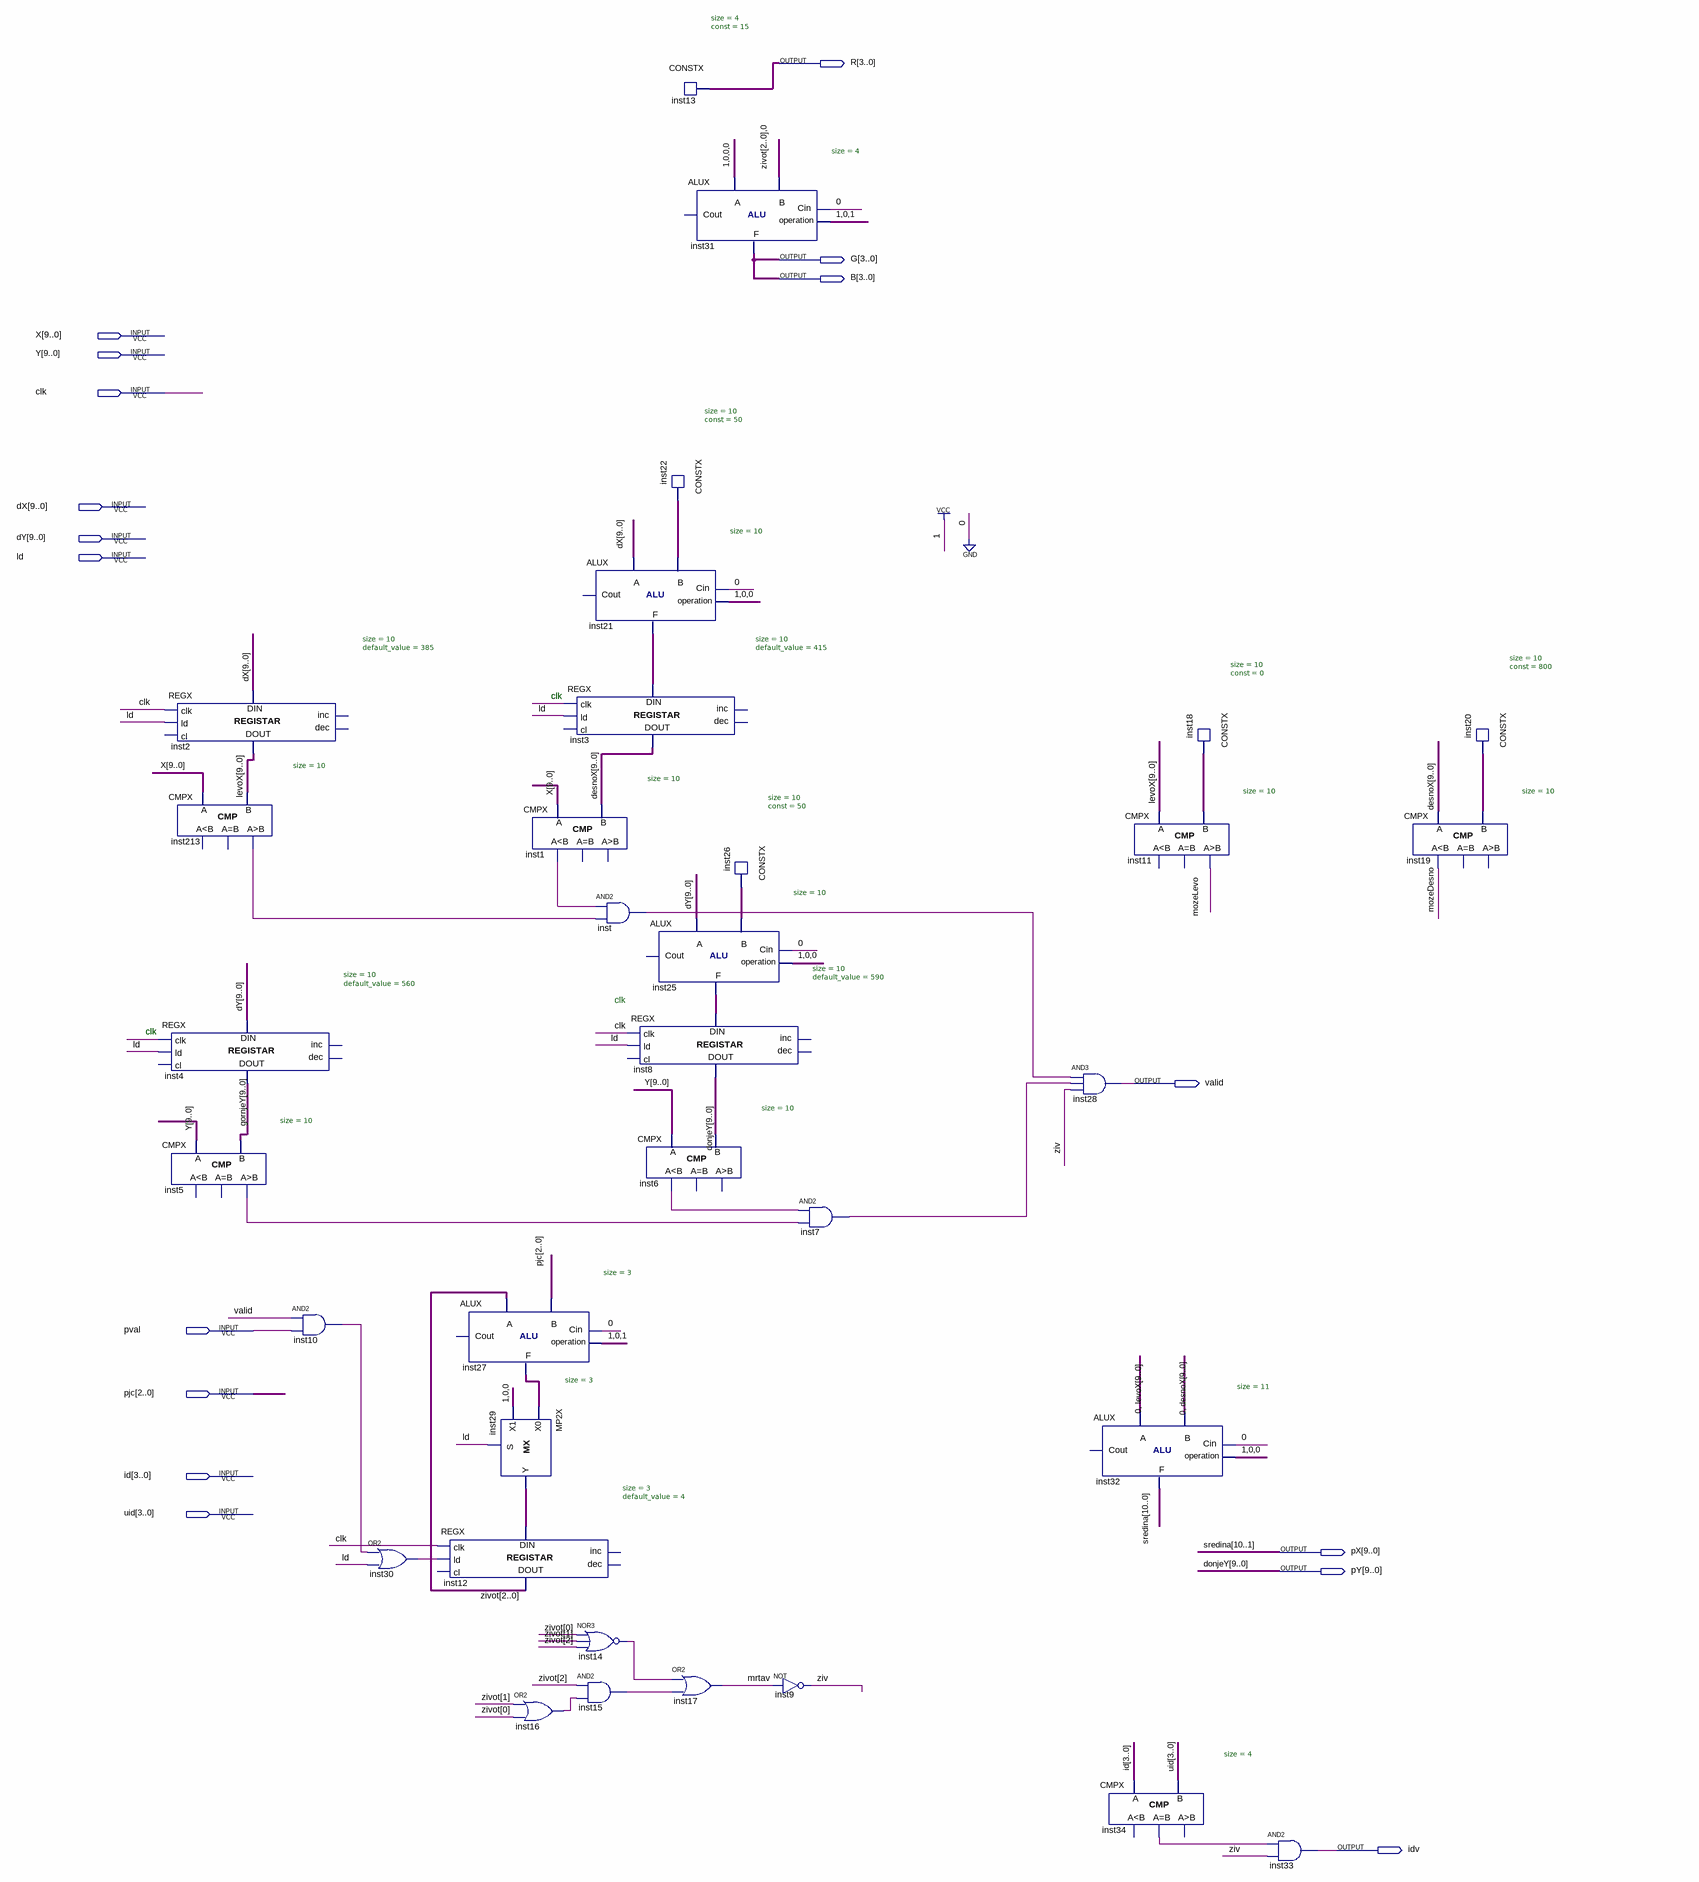
[diagram p0: schematic sheet]
// Quartus schematic neprijatelj.bdf as structural Verilog: 34 symbols, 17 pins
module neprijatelj (
  input  [9:0] X,
  input  [9:0] Y,
  input  clk,
  input  [9:0] dX,
  input  [9:0] dY,
  input  ld,
  input  pval,
  input  [2:0] pjc,
  input  [3:0] id,
  input  [3:0] uid,
  output [3:0] R,
  output [3:0] G,
  output [3:0] B,
  output valid,
  output [9:0] pX,
  output [9:0] pY,
  output idv
);

  wire inst1_ls, inst5_gr, inst6_ls, inst7_out, inst10_out, inst14_out, inst15_out, inst16_out, inst30_out,
       inst34_eq, inst213_gr, inst_out, mozeDesno, mozeLevo, mrtav, ziv;
  wire [0:0] sredina;
  wire [2:0] inst27_f, inst29_y, zivot;
  wire [9:0] desnoX, gornjeY, inst18_data, inst20_data, inst21_f, inst22_data, inst25_f, inst26_data, levoX;

  REGX #(.size(10), .default_value(385)) inst2 (
    .clk(clk), .ld(ld), .data_in(dX), .data_out(levoX));  // open: cl, inc, dec
  CMPX #(.size(10)) inst213 (.A(X), .B(levoX), .gr(inst213_gr));  // open: ls, eq
  REGX #(.size(10), .default_value(560)) inst4 (
    .clk(clk), .ld(ld), .data_in(dY), .data_out(gornjeY));  // open: cl, inc, dec
  CMPX #(.size(10)) inst5 (.A(Y), .B(gornjeY), .gr(inst5_gr));  // open: ls, eq
  and inst10 (inst10_out, valid, pval);
  or inst30 (inst30_out, inst10_out, ld);
  ALUX #(.size(3)) inst27 (.Cin(1'b0), .B(pjc), .A(zivot), .op(3'b101), .F(inst27_f));  // open: Cout
  REGX #(.size(3), .default_value(4)) inst12 (
    .clk(clk), .ld(inst30_out), .data_in(inst29_y), .data_out(zivot));  // open: cl, inc, dec
  MP2X #(.size(3)) inst29 (.S(ld), .X0(inst27_f), .X1(3'b100), .Y(inst29_y));
  CMPX #(.size(10)) inst1 (.A(X), .B(desnoX), .ls(inst1_ls));  // open: eq, gr
  or inst16 (inst16_out, zivot[1], zivot[0]);
  ALUX #(.size(10)) inst21 (.Cin(1'b0), .B(inst22_data), .A(dX), .op(3'b100), .F(inst21_f));  // open: Cout
  REGX #(.size(10), .default_value(415)) inst3 (
    .clk(clk), .ld(ld), .data_in(inst21_f), .data_out(desnoX));  // open: cl, inc, dec
  and inst (inst_out, inst1_ls, inst213_gr);
  nor inst14 (inst14_out, zivot[0], zivot[1], zivot[2]);
  and inst15 (inst15_out, zivot[2], inst16_out);
  CONSTX #(.size(10), .\const (50)) inst22 (.data(inst22_data));
  ALUX #(.size(10)) inst25 (.Cin(1'b0), .B(inst26_data), .A(dY), .op(3'b100), .F(inst25_f));  // open: Cout
  REGX #(.size(10), .default_value(590)) inst8 (
    .clk(clk), .ld(ld), .data_in(inst25_f), .data_out(pY));  // open: cl, inc, dec
  CMPX #(.size(10)) inst6 (.A(Y), .B(pY), .ls(inst6_ls));  // open: eq, gr
  CONSTX #(.size(4), .\const (15)) inst13 (.data(R));
  ALUX #(.size(4)) inst31 (.Cin(1'b0), .B({zivot, 1'b0}), .A(4'b1000), .op(3'b101), .F(B));  // open: Cout
  or inst17 (mrtav, inst14_out, inst15_out);
  CONSTX #(.size(10), .\const (50)) inst26 (.data(inst26_data));
  and inst7 (inst7_out, inst6_ls, inst5_gr);
  not inst9 (ziv, mrtav);
  and inst28 (valid, inst_out, inst7_out, ziv);
  ALUX #(.size(11)) inst32 (
    .Cin(1'b0), .B({1'b0, desnoX}), .A({1'b0, levoX}), .op(3'b100), .F({pX, sredina[0]}));  // open: Cout
  CMPX #(.size(4)) inst34 (.A(id), .B(uid), .eq(inst34_eq));  // open: ls, gr
  CMPX #(.size(10)) inst11 (.A(levoX), .B(inst18_data), .gr(mozeLevo));  // open: ls, eq
  CONSTX #(.size(10), .\const (0)) inst18 (.data(inst18_data));
  and inst33 (idv, inst34_eq, ziv);
  CMPX #(.size(10)) inst19 (.A(desnoX), .B(inst20_data), .ls(mozeDesno));  // open: eq, gr
  CONSTX #(.size(10), .\const (800)) inst20 (.data(inst20_data));

  assign G = B;

  // Other names for the same wires on the sheet: donjeY[9:0] = pY; sredina[10:1] = pX

  // Notes on the sheet:
  //   clk
  //   clk
  //   clk
endmodule
